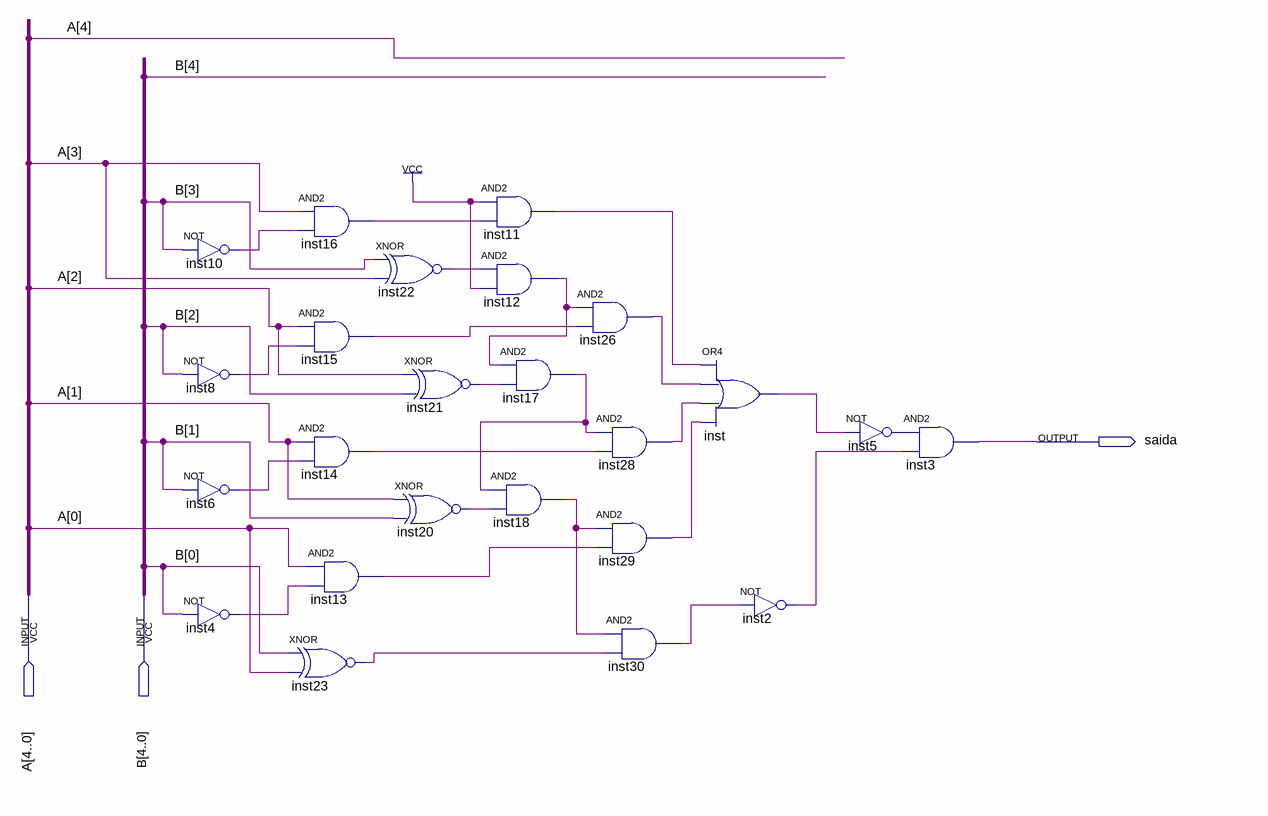
[diagram p0: schematic sheet]
// Quartus schematic comparador_menormodulo.bdf as structural Verilog: 24 symbols, 3 pins
module comparador_menormodulo (
  input  [4:0] A,
  input  [4:0] B,
  output saida
);

  wire inst2_out, inst4_out, inst5_out, inst6_out, inst8_out, inst10_out, inst11_out, inst12_out, inst13_out,
       inst14_out, inst15_out, inst16_out, inst17_out, inst18_out, inst20_out, inst21_out, inst22_out,
       inst23_out, inst26_out, inst28_out, inst29_out, inst30_out, inst_out;

  not inst10 (inst10_out, B[3]);
  not inst8 (inst8_out, B[2]);
  not inst6 (inst6_out, B[1]);
  not inst4 (inst4_out, B[0]);
  and inst16 (inst16_out, A[3], inst10_out);
  and inst15 (inst15_out, A[2], inst8_out);
  and inst14 (inst14_out, A[1], inst6_out);
  and inst13 (inst13_out, A[0], inst4_out);
  xnor inst23 (inst23_out, B[0], A[0]);
  xnor inst22 (inst22_out, B[3], A[3]);
  xnor inst21 (inst21_out, A[2], B[2]);
  xnor inst20 (inst20_out, A[1], B[1]);
  and inst11 (inst11_out, 1'b1, inst16_out);
  and inst12 (inst12_out, inst22_out, 1'b1);
  and inst17 (inst17_out, inst12_out, inst21_out);
  and inst18 (inst18_out, inst17_out, inst20_out);
  and inst26 (inst26_out, inst12_out, inst15_out);
  and inst28 (inst28_out, inst17_out, inst14_out);
  and inst29 (inst29_out, inst18_out, inst13_out);
  and inst30 (inst30_out, inst18_out, inst23_out);
  or inst (inst_out, inst11_out, inst26_out, inst28_out, inst29_out);
  not inst2 (inst2_out, inst30_out);
  not inst5 (inst5_out, inst_out);
  and inst3 (saida, inst5_out, inst2_out);
endmodule
